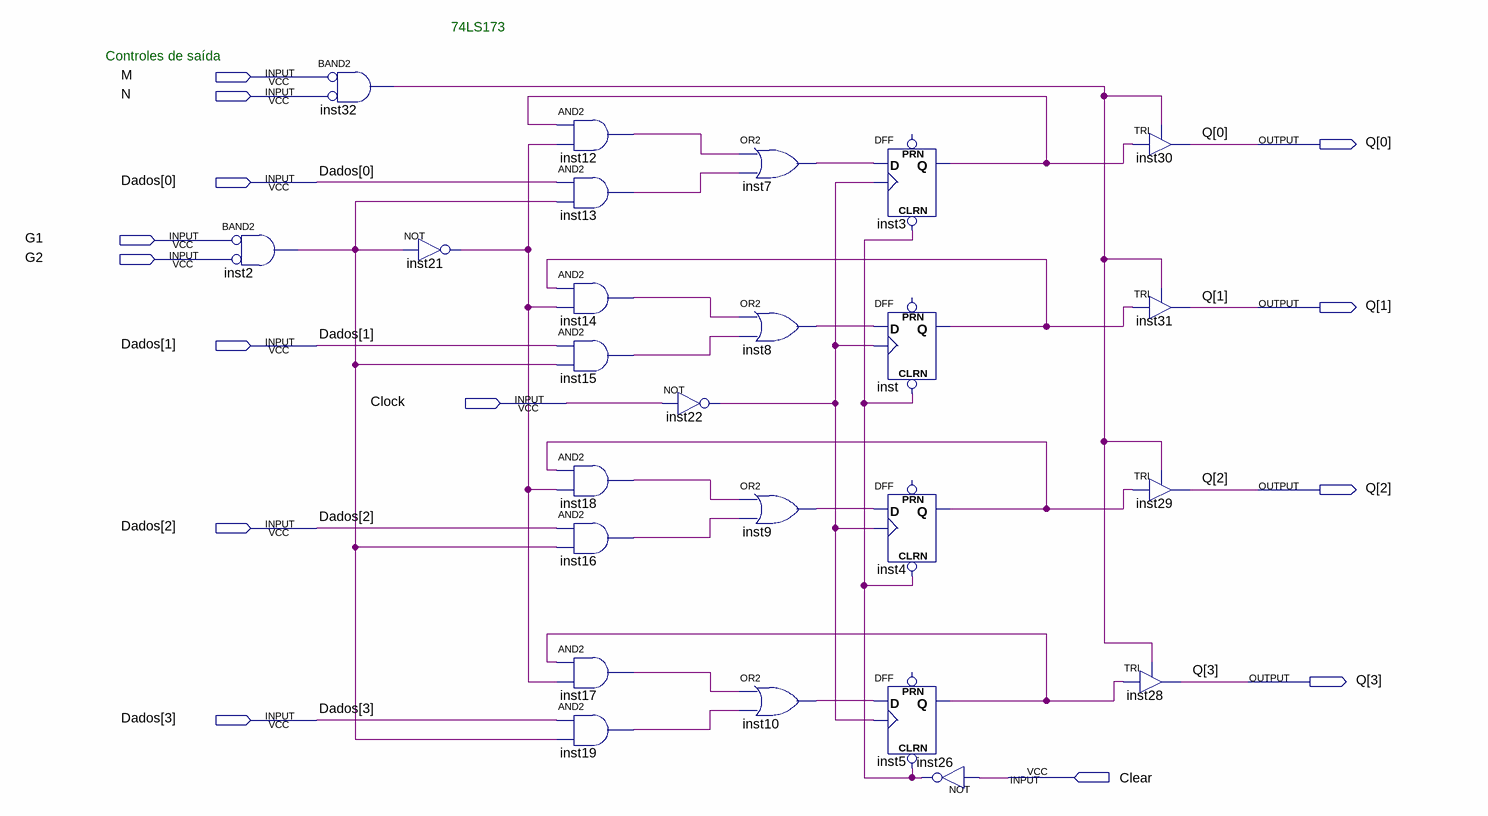
[diagram p0: schematic sheet]
// Quartus schematic 74LS173_Registrador.bdf as structural Verilog: 25 symbols, 14 pins
module \74LS173_Registrador  (
  input  M,
  input  N,
  input  [3:0] Dados,
  input  G1,
  input  G2,
  input  Clock,
  input  Clear,
  output [3:0] Q
);

  wire inst2_out, inst3_q, inst4_q, inst5_q, inst7_out, inst8_out, inst9_out, inst10_out, inst12_out,
       inst13_out, inst14_out, inst15_out, inst16_out, inst17_out, inst18_out, inst19_out, inst21_out,
       inst22_out, inst26_out, inst32_out, inst_q;

  and inst2 (inst2_out, ~G1, ~G2);  // BAND2
  and inst32 (inst32_out, ~M, ~N);  // BAND2
  not inst21 (inst21_out, inst2_out);
  and inst12 (inst12_out, inst3_q, inst21_out);
  and inst13 (inst13_out, Dados[0], inst2_out);
  and inst14 (inst14_out, inst_q, inst21_out);
  and inst15 (inst15_out, Dados[1], inst2_out);
  and inst18 (inst18_out, inst4_q, inst21_out);
  and inst16 (inst16_out, Dados[2], inst2_out);
  and inst17 (inst17_out, inst5_q, inst21_out);
  and inst19 (inst19_out, Dados[3], inst2_out);
  not inst22 (inst22_out, Clock);
  or inst7 (inst7_out, inst12_out, inst13_out);
  or inst8 (inst8_out, inst14_out, inst15_out);
  or inst9 (inst9_out, inst18_out, inst16_out);
  or inst10 (inst10_out, inst17_out, inst19_out);
  DFF inst3 (.CLRN(inst26_out), .CLK(inst22_out), .D(inst7_out), .Q(inst3_q));  // open: PRN
  DFF inst (.CLRN(inst26_out), .CLK(inst22_out), .D(inst8_out), .Q(inst_q));  // open: PRN
  DFF inst4 (.CLRN(inst26_out), .CLK(inst22_out), .D(inst9_out), .Q(inst4_q));  // open: PRN
  DFF inst5 (.CLRN(inst26_out), .CLK(inst22_out), .D(inst10_out), .Q(inst5_q));  // open: PRN
  not inst26 (inst26_out, Clear);
  TRI inst30 (.IN(inst3_q), .OE(inst32_out), .OUT(Q[0]));
  TRI inst31 (.IN(inst_q), .OE(inst32_out), .OUT(Q[1]));
  TRI inst29 (.IN(inst4_q), .OE(inst32_out), .OUT(Q[2]));
  TRI inst28 (.IN(inst5_q), .OE(inst32_out), .OUT(Q[3]));

  // Notes on the sheet:
  //   74LS173
  //   Controles de saída
endmodule
